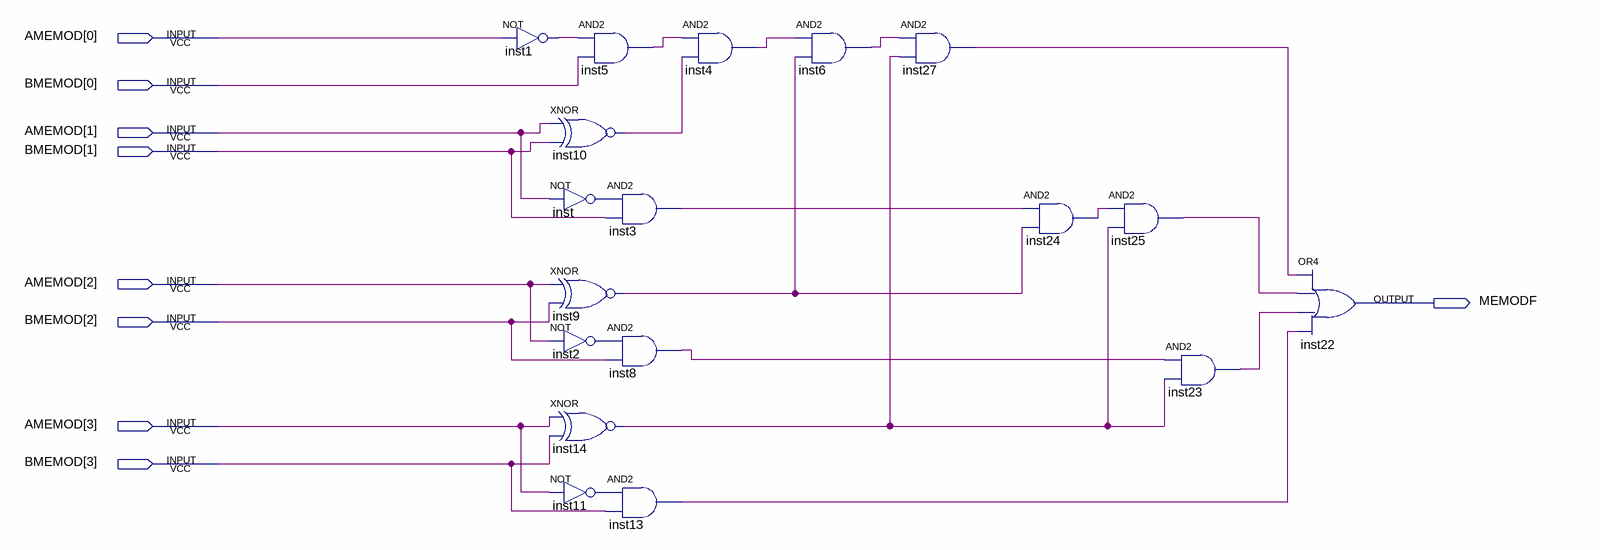
[diagram p0: schematic sheet]
// Quartus schematic AmenorBMODULO.bdf as structural Verilog: 18 symbols, 9 pins
module AmenorBMODULO (
  input  [3:0] AMEMOD,
  input  [3:0] BMEMOD,
  output MEMODF
);

  wire inst1_out, inst2_out, inst3_out, inst4_out, inst5_out, inst6_out, inst8_out, inst9_out, inst10_out,
       inst11_out, inst13_out, inst14_out, inst23_out, inst24_out, inst25_out, inst27_out, inst_out;

  not inst1 (inst1_out, AMEMOD[0]);
  xnor inst10 (inst10_out, AMEMOD[1], BMEMOD[1]);
  not inst (inst_out, AMEMOD[1]);
  xnor inst9 (inst9_out, AMEMOD[2], BMEMOD[2]);
  not inst2 (inst2_out, AMEMOD[2]);
  xnor inst14 (inst14_out, AMEMOD[3], BMEMOD[3]);
  not inst11 (inst11_out, AMEMOD[3]);
  and inst5 (inst5_out, inst1_out, BMEMOD[0]);
  and inst3 (inst3_out, inst_out, BMEMOD[1]);
  and inst8 (inst8_out, inst2_out, BMEMOD[2]);
  and inst13 (inst13_out, inst11_out, BMEMOD[3]);
  and inst4 (inst4_out, inst5_out, inst10_out);
  and inst6 (inst6_out, inst4_out, inst9_out);
  and inst27 (inst27_out, inst6_out, inst14_out);
  and inst24 (inst24_out, inst3_out, inst9_out);
  and inst25 (inst25_out, inst24_out, inst14_out);
  and inst23 (inst23_out, inst8_out, inst14_out);
  or inst22 (MEMODF, inst27_out, inst25_out, inst23_out, inst13_out);
endmodule
